# EAGLE board dacqs_host_board (EAGLE 7.7.0), part 1 of 2
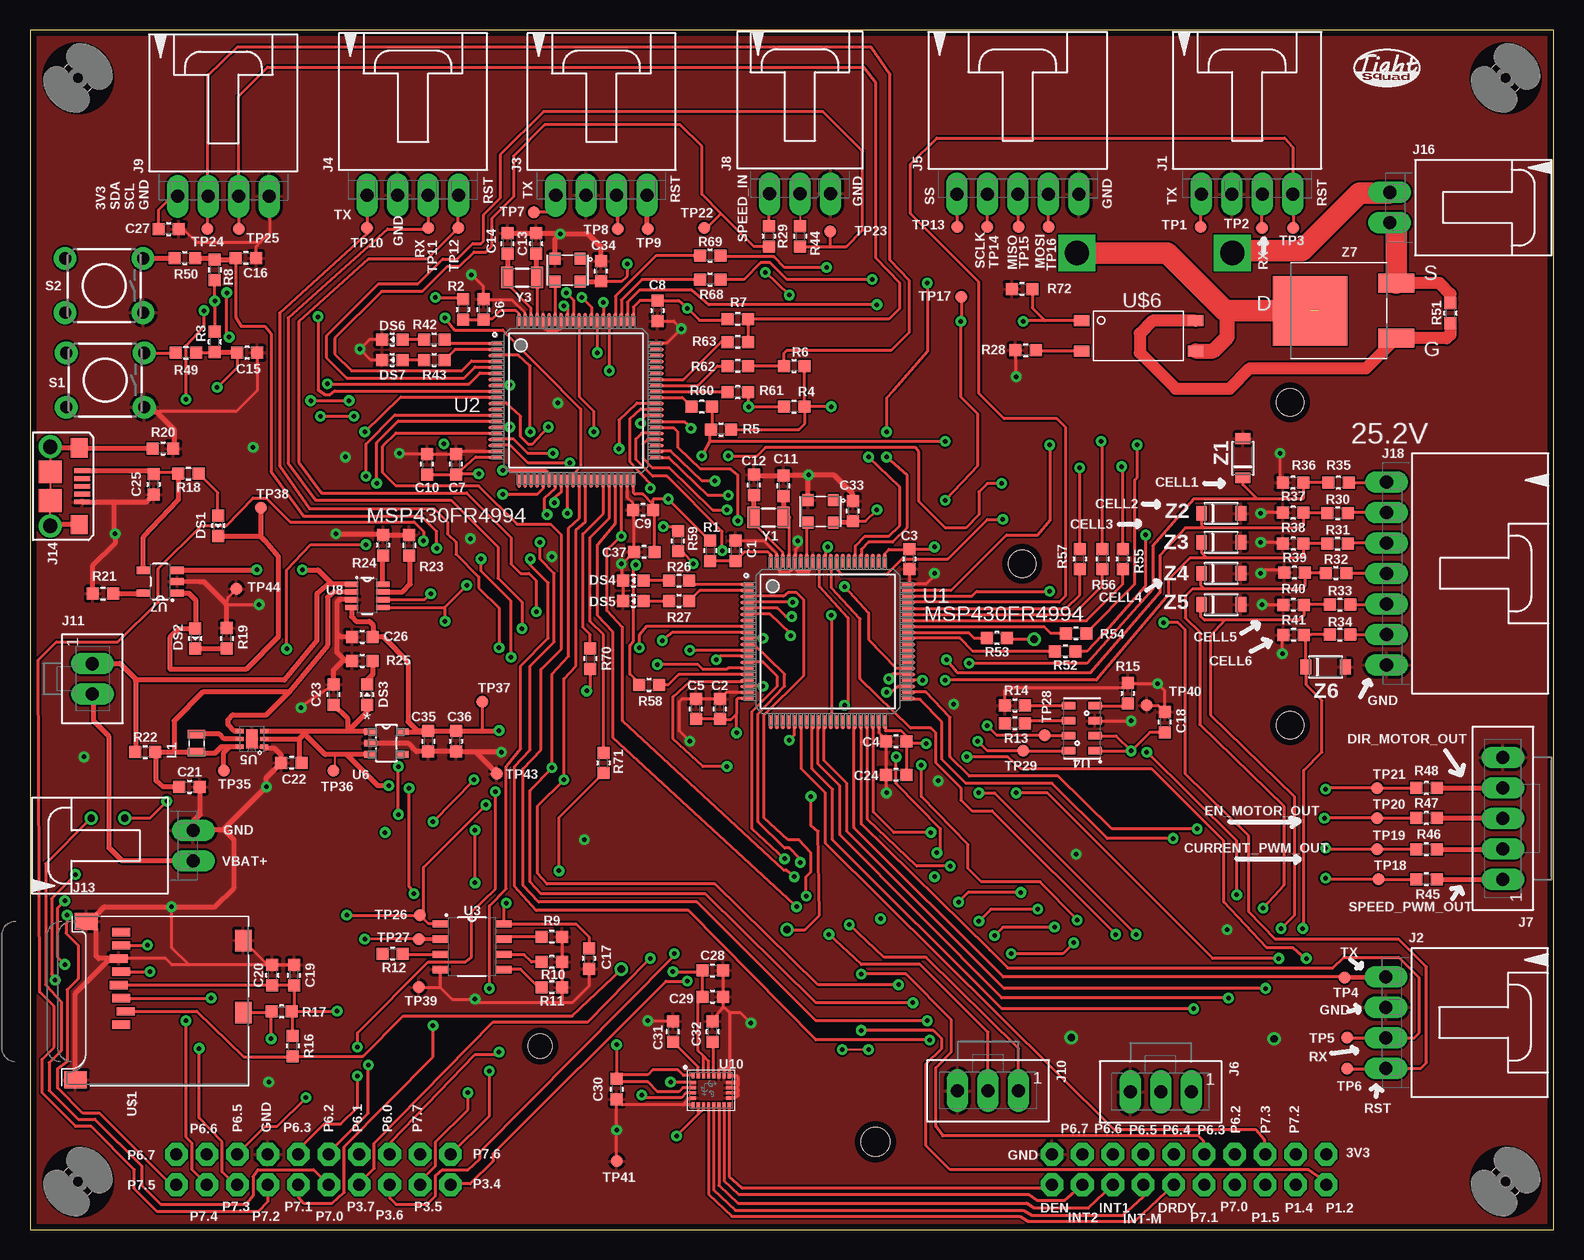
[diagram p10: board, top side]
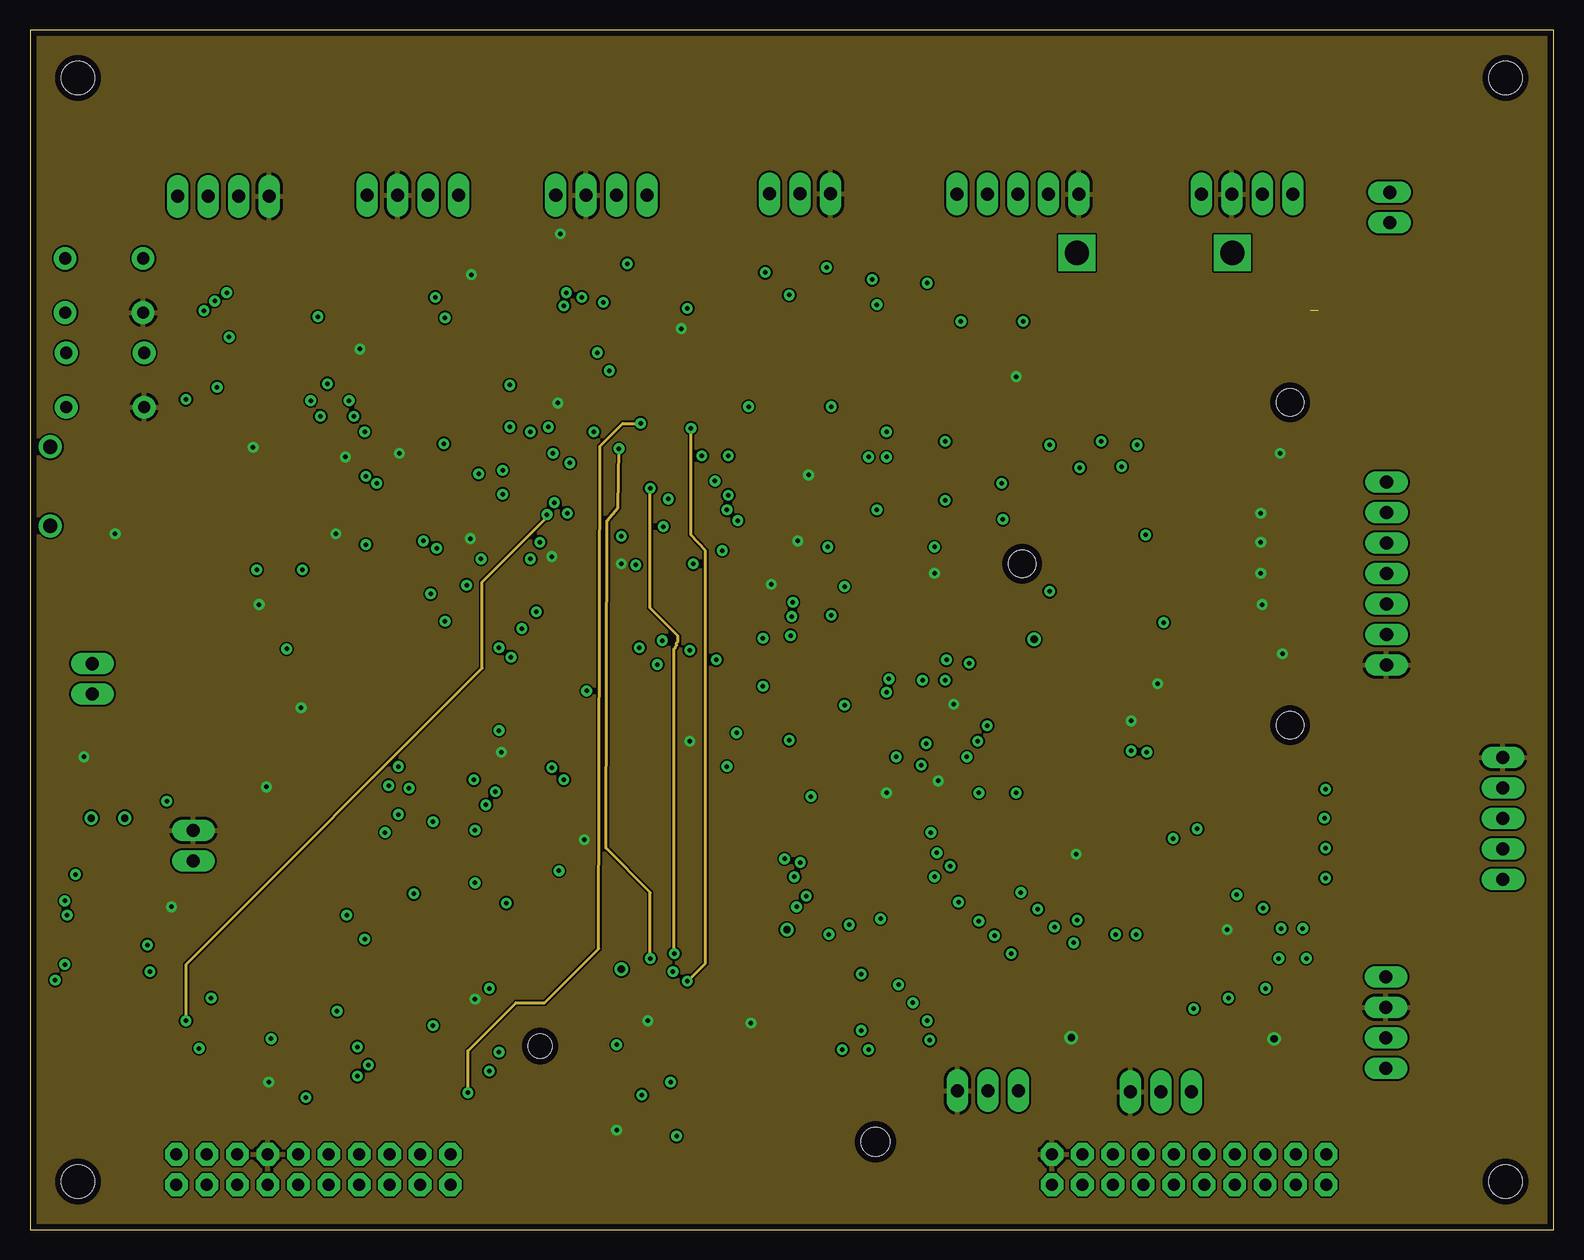
[diagram p11: board, inner layer Route2]
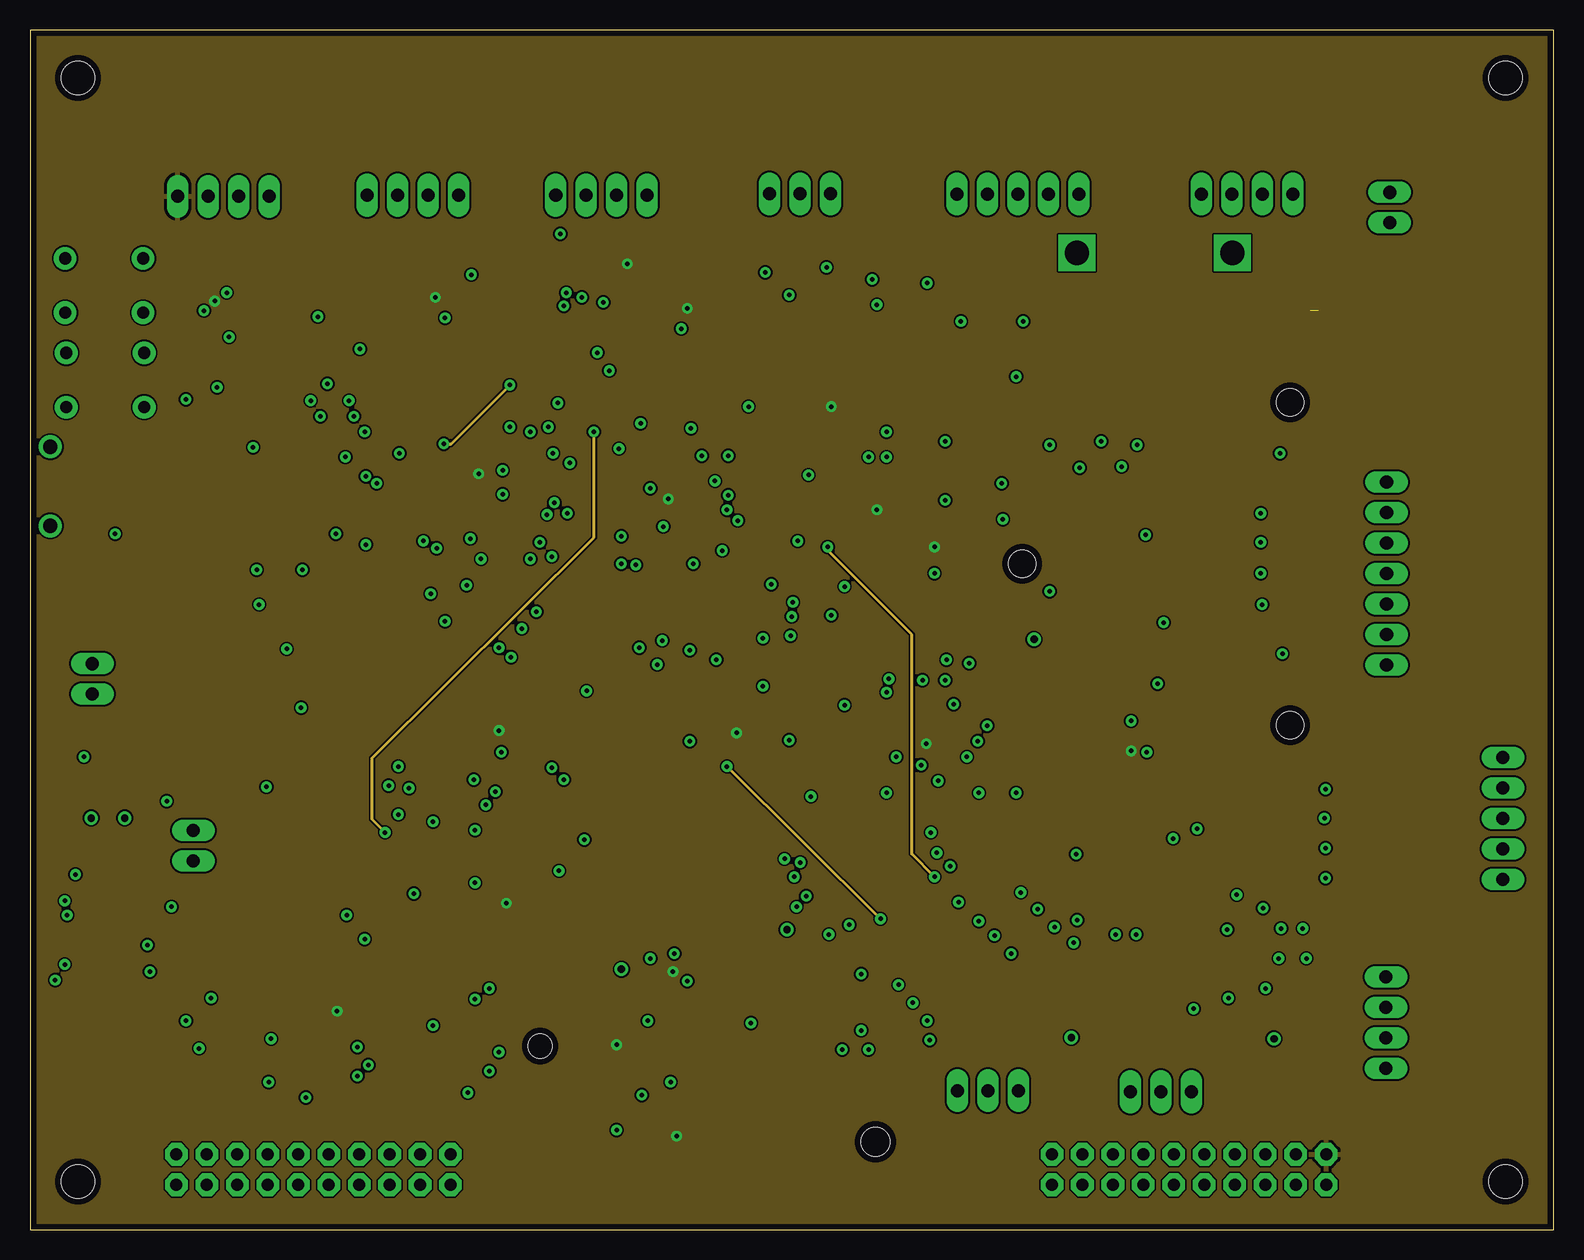
[diagram p12: board, inner layer Route15]
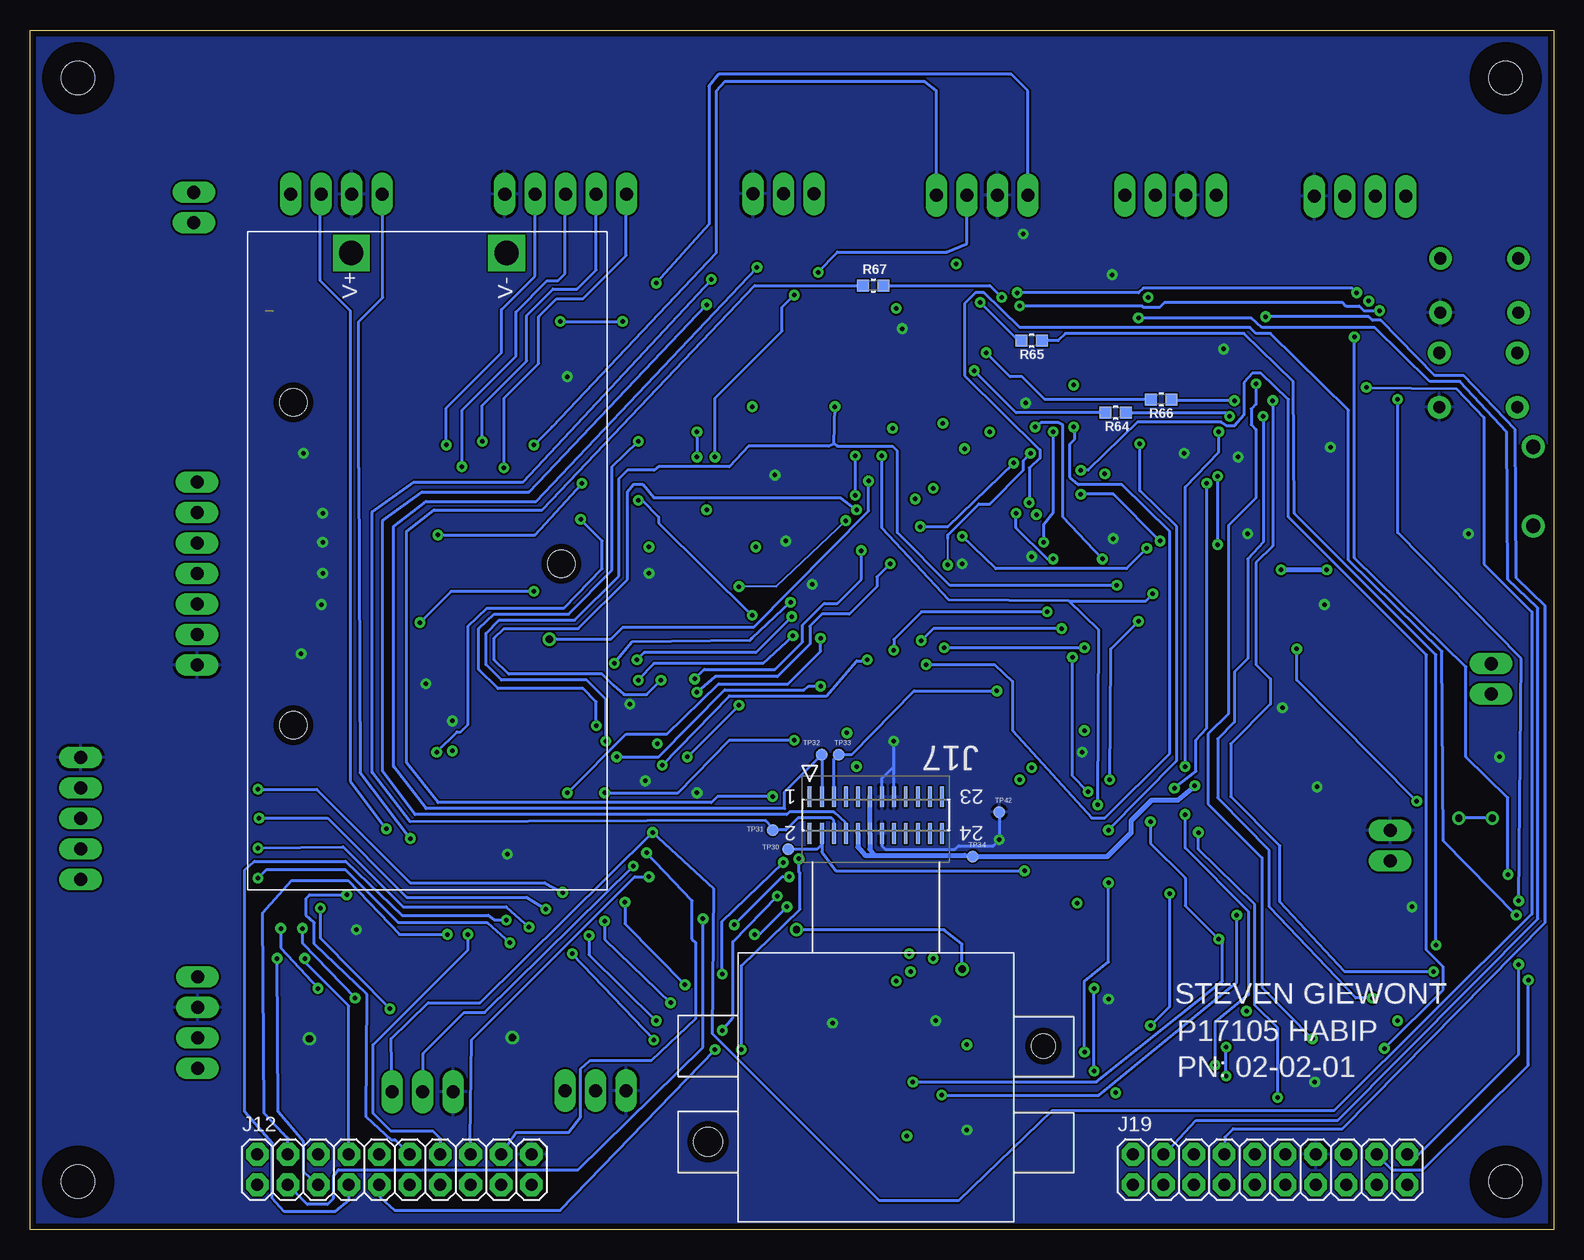
[diagram p13: board, bottom side, seen from below]

Size 127 x 100 mm. Coordinates in mm from the lower left corner, seen from the top.
Outline: 0,0 127,0 127,100 0,100 0,0
Copper layers (1+2*15+16): Top 0.035mm / dielectric 0.486mm / Route2 0.035mm / dielectric 0.488mm / Route15 0.035mm / dielectric 0.486mm / Bottom 0.035mm
Design rules "4layer_4pcb": minimum track width 6mil, minimum drill 15mil, track to track 6mil, track to pad 6mil, pad to pad 6mil, via to via 6mil, smd to smd 6mil, copper to edge 20mil, drill to drill 10mil, minimum pad ring 14mil, minimum via ring 10mil, stop-mask expansion 4mil, vias tented up to drill 16mil, thermal gap 10mil

## Footprints (pad centres in the part's own frame; a part is rotated, then mirrored left to right if it is on the bottom)
BC9VPC = drill 2.032 square: V+ 53.086,21.336; V- 53.086,8.382 | hole 2.286: 27.178,3.81; 13.716,26.162; 40.64,26.162
C0603 = smd 1 x 1: 1 -0.85,0; 2 0.85,0
LED0603 = smd 1 x 1: 1 -0.85,0; 2 0.85,0
2,75_HOLE_RASPI = hole 2.75: 0,0
MOLSL-4-RA = drill 1.09 long: 1 -3.81,-7.62; 2 -1.27,-7.62; 3 1.27,-7.62; 4 3.81,-7.62
MOLSL-5-RA = drill 1.09 long: 1 -5.08,-7.62; 2 -2.54,-7.62; 3 0,-7.62; 4 2.54,-7.62; 5 5.08,-7.62
MOLSL-3-V = drill 1.09 long: 1 -2.54,0; 2 0,0; 3 2.54,0
MOLSL-5-V = drill 1.09 long: 1 -5.08,0; 2 -2.54,0; 3 0,0; 4 2.54,0; 5 5.08,0
MOLSL-3-RA = drill 1.09 long: 1 -2.54,-7.62; 2 0,-7.62; 3 2.54,-7.62
MOLSL-2-V = drill 1.09 long: 1 -1.27,0; 2 1.27,0
2X10 = drill 1.016 pad 1.88 octagon: 1 -11.43,-1.27; 2 -11.43,1.27; 3 -8.89,-1.27; 4 -8.89,1.27; 5 -6.35,-1.27; 6 -6.35,1.27; 7 -3.81,-1.27; 8 -3.81,1.27; 9 -1.27,-1.27; 10 -1.27,1.27; 11 1.27,-1.27; 12 1.27,1.27; 13 3.81,-1.27; 14 3.81,1.27; 15 6.35,-1.27; 16 6.35,1.27; 17 8.89,-1.27; 18 8.89,1.27; 19 11.43,-1.27; 20 11.43,1.27
MOLSL-2-RA = drill 1.09 long: 1 -1.27,-7.62; 2 1.27,-7.62
MICROUSB-RIGHT = smd 0.4 x 1.35: 1 -1.3,2.675; 2 -0.65,2.675; 3 0,2.675; 4 0.65,2.675; 5 1.3,2.675 | drill 1.2 pad 1.6: S1 -3.3,0; S2 3.3,0 | smd 1.6 x 1.4: S3 -3.2,2.425; S4 3.2,2.425 | smd 1.9 x 1.9: S5 -1.2,0; S6 1.2,0
SAMTEC_CLM-112-02-L-D-IMU-MOUNT = smd 0.33 x 1.727: 1 5.512,-1.524; 2 5.512,1.524; 3 4.496,-1.524; 4 4.496,1.524; 5 3.505,-1.524; 6 3.505,1.524; 7 2.489,-1.524; 8 2.489,1.524; 9 1.499,-1.524; 10 1.499,1.524; 11 0.508,-1.524; 12 0.508,1.524; 13 -0.508,-1.524; 14 -0.508,1.524; 15 -1.499,-1.524; 16 -1.499,1.524; 17 -2.489,-1.524; 18 -2.489,1.524; 19 -3.505,-1.524; 20 -3.505,1.524; 21 -4.496,-1.524; 22 -4.496,1.524; 23 -5.512,-1.524; 24 -5.512,1.524 | hole 2.4: 13.973,27.256 | hole 2: -13.973,19.256
MOLSL-7-RA = drill 1.09 long: 1 -7.62,-7.62; 2 -5.08,-7.62; 3 -2.54,-7.62; 4 0,-7.62; 5 2.54,-7.62; 6 5.08,-7.62; 7 7.62,-7.62
WE-PMI_0805 = smd 0.7 x 1.45: 1 -0.75,0; 2 0.75,0
R0603 = smd 1 x 1: 1 -0.85,0; 2 0.85,0
TACTILE-PTH = drill 1.016 pad 1.88: 1 -3.251,2.261; 2 3.251,2.261; 3 -3.251,-2.261; 4 3.251,-2.261
TP10R = smd 1 x 1: TP 0,0
PN0080A_N = smd 1.15 x 0.3: 1 -6.725,4.75; 2 -6.725,4.25; 3 -6.725,3.75; 4 -6.725,3.25; 5 -6.725,2.75; 6 -6.725,2.25; 7 -6.725,1.75; 8 -6.725,1.25; 9 -6.725,0.75; 10 -6.725,0.25; 11 -6.725,-0.25; 12 -6.725,-0.75; 13 -6.725,-1.25; 14 -6.725,-1.75; 15 -6.725,-2.25; 16 -6.725,-2.75; 17 -6.725,-3.25; 18 -6.725,-3.75; 19 -6.725,-4.25; 20 -6.725,-4.75; 41 6.725,-4.75; 42 6.725,-4.25; 43 6.725,-3.75; 44 6.725,-3.25; 45 6.725,-2.75; 46 6.725,-2.25; 47 6.725,-1.75; 48 6.725,-1.25; 49 6.725,-0.75; 50 6.725,-0.25; 51 6.725,0.25; 52 6.725,0.75; 53 6.725,1.25; 54 6.725,1.75; 55 6.725,2.25; 56 6.725,2.75; 57 6.725,3.25; 58 6.725,3.75; 59 6.725,4.25; 60 6.725,4.75 | smd 0.3 x 1.15: 21 -4.75,-6.725; 22 -4.25,-6.725; 23 -3.75,-6.725; 24 -3.25,-6.725; 25 -2.75,-6.725; 26 -2.25,-6.725; 27 -1.75,-6.725; 28 -1.25,-6.725; 29 -0.75,-6.725; 30 -0.25,-6.725; 31 0.25,-6.725; 32 0.75,-6.725; 33 1.25,-6.725; 34 1.75,-6.725; 35 2.25,-6.725; 36 2.75,-6.725; 37 3.25,-6.725; 38 3.75,-6.725; 39 4.25,-6.725; 40 4.75,-6.725; 61 4.75,6.725; 62 4.25,6.725; 63 3.75,6.725; 64 3.25,6.725; 65 2.75,6.725; 66 2.25,6.725; 67 1.75,6.725; 68 1.25,6.725; 69 0.75,6.725; 70 0.25,6.725; 71 -0.25,6.725; 72 -0.75,6.725; 73 -1.25,6.725; 74 -1.75,6.725; 75 -2.25,6.725; 76 -2.75,6.725; 77 -3.25,6.725; 78 -3.75,6.725; 79 -4.25,6.725; 80 -4.75,6.725
SOIC127P130X0600-8N = smd 1.3 x 0.6: 1 -2.65,1.905; 2 -2.65,0.635; 3 -2.65,-0.635; 4 -2.65,-1.905; 5 2.65,-1.905; 6 2.65,-0.635; 7 2.65,0.635; 8 2.65,1.905
SMD125P110X060-8N = smd 1.1 x 0.6: 1 -1.1,1.875; 2 -1.1,0.625; 3 -1.1,-0.625; 4 -1.1,-1.875; 5 1.1,-1.875; 6 1.1,-0.625; 7 1.1,0.625; 8 1.1,1.875
SON65P200X200X80-7N = smd 0.65 x 0.356: 1 -1.025,0.65; 2 -1.025,0; 3 -1.025,-0.65; 4 1.025,-0.65; 5 1.025,0; 6 1.025,0.65 | smd 0.991 x 1.6: 7 0,0
DBV5 = smd 1.016 x 0.559: 1 -1.35,0.95; 2 -1.35,0; 3 -1.35,-0.95; 4 1.35,-0.95; 5 1.35,0.95
SOT23P110X060-5N = smd 1.1 x 0.6: 1 -1.4,0.95; 2 -1.4,0; 3 -1.4,-0.95; 4 1.4,-0.95; 5 1.4,0.95
SOT65P110X045-8N = smd 1.1 x 0.45: 1 -1.3,0.975; 2 -1.3,0.325; 3 -1.3,-0.325; 4 -1.3,-0.975; 5 1.3,-0.975; 6 1.3,-0.325; 7 1.3,0.325; 8 1.3,0.975
LGA24-8X4 = smd 0.27 x 0.45: 1 -1.505,1.225; 6 -1.505,-1.225; 7 -1.075,-1.225; 8 -0.645,-1.225; 9 -0.215,-1.225; 10 0.215,-1.225; 11 0.645,-1.225; 12 1.075,-1.225; 13 1.505,-1.225; 18 1.505,1.225; 19 1.075,1.225; 20 0.645,1.225; 21 0.215,1.225; 22 -0.215,1.225; 23 -0.645,1.225; 24 -1.075,1.225 | smd 0.45 x 0.27: 2 -1.475,0.645; 3 -1.475,0.215; 4 -1.475,-0.215; 5 -1.475,-0.645; 14 1.475,-0.645; 15 1.475,-0.215; 16 1.475,0.215; 17 1.475,0.645
MICROSD = smd 0.7 x 1.5: 1 9,-10.64; 2 7.9,-10.24; 3 6.8,-10.64; 4 5.7,-10.84; 5 4.6,-10.64; 6 3.5,-10.84; 7 2.4,-10.64; 8 1.3,-10.64 | smd 1.8 x 1.4: CD1 2,-0.44; CD2 8,-0.44 | smd 1.4 x 1.9: MT1 0.4,-13.54; MT2 13.6,-14.44
ASEMB-24MHZ-XY-T-PAC = smd 0.9 x 1: P$1 -1.05,-0.95; P$2 1.05,-0.95; P$3 1.05,0.95; P$4 -1.05,0.95
TCLD1000 = smd 1.3 x 0.9: P$1 -4.75,1.27; P$2 -4.75,-1.27; P$3 4.75,-1.27; P$4 4.75,1.27
CRYSTAL-SMD-3.2X1.5MM = smd 1 x 1.8: P$1 -1.25,0; P$2 1.25,0
MMSZ5225BT1G = smd 0.91 x 1.22: P$1 -1.635,0; P$2 1.635,0
NTD2955T4G = smd 3 x 1.6: P$1 2.79,-2.285; P$2 2.79,2.285 | smd 6.2 x 5.8: P$3 -4.39,0

## Placement (x,y rotation side)
BAT1  9V  [BC9VPC]  78.89,28.32 90 bottom
BOM1  SL 70066 4PIN HOUSING  [BLANK]  -7.3,-7.3 0 top  (outside the outline)
BOM2  SL 70066 4PIN HOUSING  [BLANK]  -7.8,-9 0 top  (outside the outline)
BOM3  SL 70066 4PIN HOUSING  [BLANK]  -8.3,-10.7 0 top  (outside the outline)
BOM4  SL 70066 4PIN HOUSING  [BLANK]  -8.8,-12.4 0 top  (outside the outline)
BOM5  SL 70058 GOLD CRIMP  [BLANK]  -9.3,-14.1 0 top  (outside the outline)
BOM6  SL 70058 GOLD CRIMP  [BLANK]  -9.8,-15.8 0 top  (outside the outline)
BOM7  SL 70058 GOLD CRIMP  [BLANK]  -10.3,-17.5 0 top  (outside the outline)
BOM8  SL 70058 GOLD CRIMP  [BLANK]  -10.8,-19.2 0 top  (outside the outline)
BOM9  SL 70058 GOLD CRIMP  [BLANK]  -11.3,-20.9 0 top  (outside the outline)
BOM10  SL 70058 GOLD CRIMP  [BLANK]  -11.8,-22.6 0 top  (outside the outline)
BOM11  SL 70058 GOLD CRIMP  [BLANK]  -12.3,-24.3 0 top  (outside the outline)
BOM12  SL 70058 GOLD CRIMP  [BLANK]  -12.8,-26 0 top  (outside the outline)
BOM13  SL 70058 GOLD CRIMP  [BLANK]  -13.3,-27.7 0 top  (outside the outline)
BOM14  SL 70058 GOLD CRIMP  [BLANK]  -13.8,-29.4 0 top  (outside the outline)
BOM15  SL 70058 GOLD CRIMP  [BLANK]  -14.3,-31.1 0 top  (outside the outline)
BOM16  SL 70058 GOLD CRIMP  [BLANK]  -14.8,-32.8 0 top  (outside the outline)
BOM17  SL 70058 GOLD CRIMP  [BLANK]  -15.3,-34.5 0 top  (outside the outline)
BOM18  SL 70058 GOLD CRIMP  [BLANK]  -15.8,-36.2 0 top  (outside the outline)
BOM19  SL 70058 GOLD CRIMP  [BLANK]  -16.3,-37.9 0 top  (outside the outline)
BOM20  SL 70058 GOLD CRIMP  [BLANK]  -16.8,-39.6 0 top  (outside the outline)
BOM21  SL 70066 5PIN HOUSING  [BLANK]  -17.3,-41.3 0 top  (outside the outline)
BOM22  SL 70058 GOLD CRIMP  [BLANK]  -17.8,-43 0 top  (outside the outline)
BOM23  SL 70058 GOLD CRIMP  [BLANK]  -18.3,-44.7 0 top  (outside the outline)
BOM24  SL 70058 GOLD CRIMP  [BLANK]  -18.8,-46.4 0 top  (outside the outline)
BOM25  SL 70058 GOLD CRIMP  [BLANK]  -19.3,-48.1 0 top  (outside the outline)
BOM26  SL 70058 GOLD CRIMP  [BLANK]  -19.8,-49.8 0 top  (outside the outline)
BOM27  SL 70066 3PIN HOUSING  [BLANK]  -20.3,-51.5 0 top  (outside the outline)
BOM28  SL 70058 GOLD CRIMP  [BLANK]  -20.8,-53.2 0 top  (outside the outline)
BOM29  SL 70058 GOLD CRIMP  [BLANK]  -21.3,-54.9 0 top  (outside the outline)
BOM30  SL 70058 GOLD CRIMP  [BLANK]  -21.8,-56.6 0 top  (outside the outline)
BOM31  SL 70066 2PIN HOUSING  [BLANK]  -22.3,-58.3 0 top  (outside the outline)
BOM32  SL 70058 GOLD CRIMP  [BLANK]  -22.8,-60 0 top  (outside the outline)
BOM33  SL 70058 GOLD CRIMP  [BLANK]  -23.3,-61.7 0 top  (outside the outline)
BOM34  SL 70066 5PIN HOUSING  [BLANK]  -23.8,-63.4 0 top  (outside the outline)
BOM35  SL 70058 GOLD CRIMP  [BLANK]  -24.3,-65.1 0 top  (outside the outline)
BOM36  SL 70058 GOLD CRIMP  [BLANK]  -24.8,-66.8 0 top  (outside the outline)
BOM37  SL 70058 GOLD CRIMP  [BLANK]  -25.3,-68.5 0 top  (outside the outline)
BOM38  SL 70058 GOLD CRIMP  [BLANK]  -25.8,-70.2 0 top  (outside the outline)
BOM39  SL 70058 GOLD CRIMP  [BLANK]  -26.3,-71.9 0 top  (outside the outline)
BOM40  SL 70066 3PIN HOUSING  [BLANK]  -26.8,-73.6 0 top  (outside the outline)
BOM41  SL 70058 GOLD CRIMP  [BLANK]  -27.3,-75.3 0 top  (outside the outline)
BOM42  SL 70058 GOLD CRIMP  [BLANK]  -27.8,-77 0 top  (outside the outline)
BOM43  SL 70058 GOLD CRIMP  [BLANK]  -28.3,-78.7 0 top  (outside the outline)
BOM44  SL 70066 4PIN HOUSING  [BLANK]  -28.8,-80.4 0 top  (outside the outline)
BOM45  SL 70058 GOLD CRIMP  [BLANK]  -29.3,-82.1 0 top  (outside the outline)
BOM46  SL 70058 GOLD CRIMP  [BLANK]  -29.8,-83.8 0 top  (outside the outline)
BOM47  SL 70058 GOLD CRIMP  [BLANK]  -30.3,-85.5 0 top  (outside the outline)
BOM48  SL 70058 GOLD CRIMP  [BLANK]  -30.8,-87.2 0 top  (outside the outline)
BOM49  SL 70066 2PIN HOUSING  [BLANK]  -31.3,-88.9 0 top  (outside the outline)
BOM50  SL 70058 GOLD CRIMP  [BLANK]  -31.8,-90.6 0 top  (outside the outline)
BOM51  SL 70058 GOLD CRIMP  [BLANK]  -32.3,-92.3 0 top  (outside the outline)
BOM52  SL 70066 2PIN HOUSING  [BLANK]  -32.8,-94 0 top  (outside the outline)
BOM53  SL 70058 GOLD CRIMP  [BLANK]  -33.3,-95.7 0 top  (outside the outline)
BOM54  SL 70058 GOLD CRIMP  [BLANK]  -33.8,-97.4 0 top  (outside the outline)
BOM55  SL 70066 7PIN HOUSING  [BLANK]  -34.3,-99.1 0 top  (outside the outline)
BOM56  SL 70058 GOLD CRIMP  [BLANK]  -34.8,-100.8 0 top  (outside the outline)
BOM57  SL 70058 GOLD CRIMP  [BLANK]  -35.3,-102.5 0 top  (outside the outline)
BOM58  SL 70058 GOLD CRIMP  [BLANK]  -35.8,-104.2 0 top  (outside the outline)
BOM59  SL 70058 GOLD CRIMP  [BLANK]  -36.3,-105.9 0 top  (outside the outline)
BOM60  SL 70058 GOLD CRIMP  [BLANK]  -36.8,-107.6 0 top  (outside the outline)
BOM61  SL 70058 GOLD CRIMP  [BLANK]  -37.3,-109.3 0 top  (outside the outline)
BOM62  SL 70058 GOLD CRIMP  [BLANK]  -37.8,-111 0 top  (outside the outline)
BOM63  1-Cell 2500mAh Li-Ion Battery  [BLANK]  -38.3,-112.7 0 top  (outside the outline)
C1  100nF  [C0603]  58.8,56.6 90 top
C2  100nF  [C0603]  57.5,43.4 90 top
C3  100nF  [C0603]  73.3,55.9 270 top
C4  100nF  [C0603]  72.2,40.7 180 top
C5  10uF  [C0603]  55.5,43.4 90 top
C6  100nF  [C0603]  37.8,76.7 90 top
C7  100nF  [C0603]  35.5,63.8 90 top
C8  100nF  [C0603]  52.3,76.6 270 top
C9  100nF  [C0603]  51.1,60 180 top
C10  10uF  [C0603]  33.1,63.8 90 top
C11  22pF  [C0603]  62.8,62 90 top
C12  22pF  [C0603]  60.34,62.07 90 top
C13  22pF  [C0603]  42.2,82.2 90 top
C14  22pF  [C0603]  39.8,82.2 90 top
C15  1000pF  [C0603]  18.1,73.1 180 top
C16  1000pF  [C0603]  18,81 180 top
C17  100nF  [C0603]  46.6,22.6 270 top
C18  100nF  [C0603]  94.6,42.3 90 top
C19  1uF  [C0603]  22,21.2 90 top
C20  100nF  [C0603]  20.2,21.2 90 top
C21  2.2uF  [C0603]  13.3,36.9 0 top
C22  4.7uF  [C0603]  21.8,38.9 180 top
C23  1uF  [C0603]  25.3,44.6 90 top
C24  1uF  [C0603]  72.2,37.9 180 top
C25  10uF  [C0603]  10.31,62.12 270 top
C26  100nF  [C0603]  27.7,49.4 0 top
C27  100nF  [C0603]  11.56,83.41 0 top
C28  10uF  [C0603]  56.9,21.6 0 top
C29  100nF  [C0603]  56.9,19.4 0 top
C30  100nF  [C0603]  48.9,11.7 270 top
C31  100nF  [C0603]  53.6,16.5 90 top
C32  10000pF  [C0603]  56.9,16.5 90 top
C33  10000pF  [C0603]  68.6,59.9 90 top
C34  10000pF  [C0603]  47.6,79.9 90 top
C35  10uF  [C0603]  33.2,40.7 270 top
C36  100nF  [C0603]  35.5,40.7 270 top
C37  1uF  [C0603]  51.2,56.5 180 top
DS1  YELLOW  [LED0603]  15.69,58.68 90 top
DS2  GREEN  [LED0603]  13.79,49.27 90 top
DS3  BLUE  [LED0603]  28.1,44.6 270 top
DS4  GREEN  [LED0603]  50.3,54.1 0 top
DS5  BLUE  [LED0603]  50.3,52.4 0 top
DS6  GREEN  [LED0603]  30.2,74.2 0 top
DS7  BLUE  [LED0603]  30.2,72.5 0 top
H1  MOUNT-HOLE_2.75  [2,75_HOLE_RASPI]  123,4 0 top
H2  MOUNT-HOLE_2.75  [2,75_HOLE_RASPI]  4,4 0 top
H3  MOUNT-HOLE_2.75  [2,75_HOLE_RASPI]  123,96 0 top
H4  MOUNT-HOLE_2.75  [2,75_HOLE_RASPI]  4,96 0 top
J1  MOL-SL-4-RA  [MOLSL-4-RA]  101.46,93.95 0 top
J2  MOL-SL-4-RA  [MOLSL-4-RA]  120.65,17.25 270 top
J3  MOL-SL-4-RA  [MOLSL-4-RA]  47.64,93.85 0 top
J4  MOL-SL-4-RA  [MOLSL-4-RA]  31.93,93.85 0 top
J5  MOL-SL-5-RA  [MOLSL-5-RA]  82.34,93.95 0 top
J6  MOL-SL-3-V  [MOLSL-3-V]  94.26,11.48 180 top
J7  MOL-SL-5-V  [MOLSL-5-V]  122.78,34.28 90 top
J8  MOL-SL-3-RA  [MOLSL-3-RA]  64.18,93.96 0 top
J9  MOL-SL-4-RA  [MOLSL-4-RA]  16.12,93.75 0 top
J10  MOL-SL-3-V  [MOLSL-3-V]  79.86,11.58 180 top
J11  MOL-SL-2-V  [MOLSL-2-V]  5.2,45.9 270 top
J12  CONN HEADER 20POS .100" DBL  [2X10]  96.62,5 0 bottom
J13  MOL-SL-2-RA  [MOLSL-2-RA]  6,32 90 top
J14  USB_MICROB_RECPT  [MICROUSB-RIGHT]  1.69,61.96 270 top
J16  MOL-SL-2-RA  [MOLSL-2-RA]  120.96,85.19 270 top
J17  CLM-112-02-L-D-IMU-MOUNT_IMU  [SAMTEC_CLM-112-02-L-D-IMU-MOUNT]  56.49,34.55 180 bottom
J18  MOLSL-7-RA  [MOLSL-7-RA]  120.7,54.69 270 top
J19  CONN HEADER 20POS .100" DBL  [2X10]  23.63,5 0 bottom
L1  1uH  [WE-PMI_0805]  13.89,40.53 90 top
R1  0  [R0603]  56.7,56.6 270 top
R2  0  [R0603]  36.1,76.7 270 top
R3  47k  [R0603]  15.4,74 90 top
R4  2.61k  [R0603]  63.7,68.6 0 top
R5  2.61k  [R0603]  57.6,66.7 0 top
R6  2.61k  [R0603]  63.7,72 0 top
R7  2.61k  [R0603]  59,75.9 180 top
R8  47k  [R0603]  15.4,80 270 top
R9  0  [R0603]  43.5,24.4 180 top
R10  0  [R0603]  43.5,22.3 180 top
R11  0  [R0603]  43.5,20.2 180 top
R12  0  [R0603]  30.23,22.98 180 top
R13  0  [R0603]  82.1,42.2 180 top
R14  0  [R0603]  82.1,43.7 0 top
R15  0  [R0603]  91.5,44.7 270 top
R16  47k  [R0603]  21.9,15.3 270 top
R17  100k  [R0603]  20.98,18.18 180 top
R18  2k  [R0603]  13.21,63.02 0 top
R19  2k  [R0603]  16.4,49.28 270 top
R20  0  [R0603]  11.09,65.12 0 top
R21  2k  [R0603]  6.08,53.02 0 top
R22  4  [R0603]  9.6,39.8 0 top
R23  0  [R0603]  31.62,57.04 270 top
R24  0  [R0603]  29.42,57.05 270 top
R25  1k  [R0603]  27.7,47.4 0 top
R26  2k  [R0603]  54.1,54.1 0 top
R27  2k  [R0603]  54.1,52.4 0 top
R28  2k  [R0603]  83,73.3 0 top
R29  0  [R0603]  61.6,82.8 270 top
R30  10.2k  [R0603]  109.01,59.72 0 top
R31  10.7k  [R0603]  109,57.18 0 top
R32  4.12k  [R0603]  108.86,54.73 0 top
R33  10.2k  [R0603]  109.2,52.1 0 top
R34  1.02k  [R0603]  109.2,49.6 0 top
R35  68.1k  [R0603]  109.07,62.27 180 top
R36  7.5k  [R0603]  105.28,62.27 180 top
R37  1.37k  [R0603]  105.29,59.77 180 top
R38  1.87k  [R0603]  105.3,57.17 180 top
R39  1.02k  [R0603]  105.41,54.77 180 top
R40  4.32k  [R0603]  105.32,52.07 180 top
R41  1.5k  [R0603]  105.33,49.57 180 top
R42  2k  [R0603]  33.7,74.2 0 top
R43  2k  [R0603]  33.7,72.5 0 top
R44  0  [R0603]  64.2,82.8 270 top
R45  0  [R0603]  116.4,29.2 180 top
R46  0  [R0603]  116.4,31.7 180 top
R47  0  [R0603]  116.4,34.3 180 top
R48  0  [R0603]  116.4,36.8 180 top
R49  49.9  [R0603]  13,73.1 0 top
R50  49.9  [R0603]  12.9,81 0 top
R51  47k  [R0603]  118.4,76.4 90 top
R52  23.2  [R0603]  86.3,48.2 180 top
R53  23.2  [R0603]  80.6,49.3 180 top
R54  23.2  [R0603]  87.2,49.7 180 top
R55  23.2  [R0603]  91.1,55.9 270 top
R56  23.2  [R0603]  89.4,55.9 270 top
R57  23.2  [R0603]  87.5,55.9 270 top
R58  23.2  [R0603]  51.6,45.4 0 top
R59  23.2  [R0603]  54,57.4 90 top
R60  23.2  [R0603]  56,68.6 180 top
R61  23.2  [R0603]  59,69.8 180 top
R62  23.2  [R0603]  59,72 180 top
R63  23.2  [R0603]  59,74 180 top
R64  23.2  [R0603]  36.5,68.1 180 bottom
R65  23.2  [R0603]  43.5,74.1 180 bottom
R66  23.2  [R0603]  32.7,69.2 180 bottom
R67  23.2  [R0603]  56.7,78.7 0 bottom
R68  23.2  [R0603]  56.7,79.2 0 top
R69  23.2  [R0603]  56.7,81.2 0 top
R70  23.2  [R0603]  46.7,47.6 270 top
R71  23.2  [R0603]  47.8,38.9 270 top
R72  49.9k  [R0603]  82.7,78.4 180 top
S1  SWITCH-MOMENTARY-2PTH  [TACTILE-PTH]  6.27,70.82 180 top
S2  SWITCH-MOMENTARY-2PTH  [TACTILE-PTH]  6.18,78.7 180 top
TP1  [TP10R]  97.6,83.6 0 top
TP2  [TP10R]  102.7,83.5 0 top
TP3  [TP10R]  105.3,83.5 0 top
TP4  [TP10R]  109.6,21 0 top
TP5  [TP10R]  109.8,16 0 top
TP6  [TP10R]  109.8,13.4 0 top
TP7  [TP10R]  42,84.8 0 top
TP8  [TP10R]  49,83.4 0 top
TP9  [TP10R]  51.5,83.4 0 top
TP10  [TP10R]  28.1,83.5 0 top
TP11  [TP10R]  33.2,83.5 0 top
TP12  [TP10R]  35.7,83.5 0 top
TP13  [TP10R]  77.3,83.6 0 top
TP14  [TP10R]  79.8,83.6 0 top
TP15  [TP10R]  82.4,83.6 0 top
TP16  [TP10R]  84.9,83.6 0 top
TP17  [TP10R]  77.63,77.76 0 top
TP18  [TP10R]  112.4,29.2 0 top
TP19  [TP10R]  112.3,31.7 0 top
TP20  [TP10R]  112.3,34.3 0 top
TP21  [TP10R]  112.3,36.8 0 top
TP22  [TP10R]  56.2,83.5 0 top
TP23  [TP10R]  66.7,83.2 0 top
TP24  [TP10R]  14.8,83.4 0 top
TP25  [TP10R]  17.4,83.4 0 top
TP26  [TP10R]  32.5,26.2 0 top
TP27  [TP10R]  32.4,24.2 0 top
TP28  [TP10R]  84.6,41.2 0 top
TP29  [TP10R]  82.8,39.9 0 top
TP30  [TP10R]  63.8,31.7 0 bottom
TP31  [TP10R]  65.1,33.3 0 bottom
TP32  [TP10R]  61,39.6 0 bottom
TP33  [TP10R]  59.6,39.6 0 bottom
TP34  [TP10R]  48.4,31.1 0 bottom
TP35  [TP10R]  16.15,38.27 0 top
TP36  [TP10R]  25.31,38.27 0 top
TP37  [TP10R]  37.7,44 0 top
TP38  [TP10R]  19.23,60.17 0 top
TP39  [TP10R]  32.4,20.2 0 top
TP40  [TP10R]  93.1,43.7 0 top
TP41  [TP10R]  48.9,5.7 0 top
TP42  [TP10R]  46.2,34.8 0 bottom
TP43  [TP10R]  38.9,38 0 top
TP44  [TP10R]  17.2,53.4 0 top
U1  MSP430FR4994  [PN0080A_N]  66.5,49.02 0 top
U2  MSP430FR4994  [PN0080A_N]  45.52,69.12 0 top
U3  PCT2075D,118  [SOIC127P130X0600-8N]  36.85,23.58 0 top
U4  MS560702BA03-50  [SMD125P110X060-8N]  87.69,41.79 180 top
U5  TPS61240DRVR  [SON65P200X200X80-7N]  18.5,40.9 180 top
U6  LP5907_DBV_5  [DBV5]  29.7,40.55 0 top
U7  MCP73831T  [SOT23P110X060-5N]  10.85,54.01 180 top
U8  INA219AIDCNR  [SOT65P110X045-8N]  28.11,52.83 0 top
U10  LSM9DS1  [LGA24-8X4]  56.78,11.61 0 top
U$1  MICROSD  [MICROSD]  18.23,26.09 270 top
U$4  ASEMB-24MHZ-XY-T  [ASEMB-24MHZ-XY-T-PAC]  65.9,59.87 180 top
U$5  ASEMB-24MHZ-XY-T  [ASEMB-24MHZ-XY-T-PAC]  44.81,79.97 180 top
U$6  TCLD1000  [TCLD1000]  92.4,74.5 0 top
U$8  [SQUAD_LOGO]  110.3,95.2 0 top
Y1  32.768kHz  [CRYSTAL-SMD-3.2X1.5MM]  61.58,59.37 180 top
Y3  32.768kHz  [CRYSTAL-SMD-3.2X1.5MM]  41.03,79.37 180 top
Z1  MMSZ5225BT1G  [MMSZ5225BT1G]  101.1,64.3 90 top
Z2  MMSZ5225BT1G  [MMSZ5225BT1G]  99.3,59.7 0 top
Z3  MMSZ5225BT1G  [MMSZ5225BT1G]  99.3,57.3 0 top
Z4  MMSZ5225BT1G  [MMSZ5225BT1G]  99.3,54.7 0 top
Z5  MMSZ5225BT1G  [MMSZ5225BT1G]  99.3,52.1 0 top
Z6  MMSZ5225BT1G  [MMSZ5225BT1G]  108,46.9 0 top
Z7  [NTD2955T4G]  111.1,76.6 0 top